# Altium schematic sheet pic16f627.schdoc
size A4
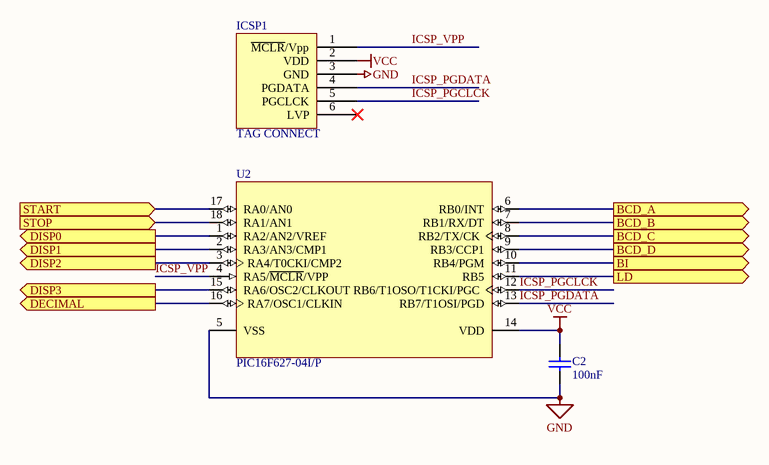
[diagram p0: pic16f627.schdoc]

## Parts
C2  value 100nF  [CAP (3D) - 0603]  (hidden comment: Cap)
ICSP1  TAG CONNECT  [ICSP - TAG CONNECT]
U2  PIC16F627-04I/P  [SOIC-18]

## Ports
BCD_A (out), BCD_B (out), BCD_C (out), BCD_D (out), BI (out), DECIMAL (out), DISP0 (out), DISP1 (out), DISP2 (out), DISP3 (out), LD (out), START (in), STOP (in)

## Nets
GND: C2.1 ICSP1.3(GND) U2.5(VSS)
VCC: C2.2 ICSP1.2(VDD) U2.14(VDD)
BCD_A: U2.6(RB0/INT) ; port BCD_A
BCD_B: U2.7(RB1/RX/DT) ; port BCD_B
BCD_C: U2.8(RB2/TX/CK) ; port BCD_C
BCD_D: U2.9(RB3/CCP1) ; port BCD_D
BI: U2.10(RB4/PGM) ; port BI
DECIMAL: U2.16(RA7/OSC1/CLKIN) ; port DECIMAL
DISP0: U2.1(RA2/AN2/VREF) ; port DISP0
DISP1: U2.2(RA3/AN3/CMP1) ; port DISP1
DISP2: U2.3(RA4/T0CKI/CMP2) ; port DISP2
DISP3: U2.15(RA6/OSC2/CLKOUT) ; port DISP3
ICSP_PGCLCK: ICSP1.5(PGCLCK) U2.12(RB6/T1OSO/T1CKI/PGC)
ICSP_PGDATA: ICSP1.4(PGDATA) U2.13(RB7/T1OSI/PGD)
ICSP_VPP: ICSP1.1(~{MCLR}/Vpp) U2.4(RA5/~{MCLR}/VPP)
LD: U2.11(RB5) ; port LD
START: U2.17(RA0/AN0) ; port START
STOP: U2.18(RA1/AN1) ; port STOP

Not connected (* = marked no-connect by the designer): ICSP1 6(LVP)*

## Library data of the parts
C2 = Cap: Capacitor; Manufacturer: Murata; Manufacturer Part No.: GCM188R71C104KA37D; Mouser Part No.: 81-GCM188R71C104KA7D; Web link: http://au.mouser.com/ProductDetail/Murata/GCM188R71C104KA37D/?qs=aEuGZpxfbxWKAxwYn%252beTMg%3d%3d
ICSP1 = ICSP - TAG CONNECT: Manufacturer: N/A - PCB ARTWORK; value: ICSP1; Manufacturer Part No.: N/A; Mouser Part no.: N/A; Web link: N/A
U2 = PIC16F627-04I/P: FLASH-Based 8-Bit CMOS Microcontroller, 1K (x14-Bit words) FLASH, 224 Bytes RAM, 4 MHz, 18-Pin PDIP, 3.0 to 5.5V Supply Range, Industrial Temperature; Manufacturer: MICROCHIP SEMICONDUCTOR; Value: PIC16F627A-I/SO; Mouser Part No.: 579-PIC16F627A-I/SO; Manufacturer Part No.: PIC16F627A-I/SO; Web link: http://au.mouser.com/ProductDetail/Microchip-Technology/PIC16F627A-I-SO/?qs=sGAEpiMZZMsUzhEcHltCuSCJArmd4E5f